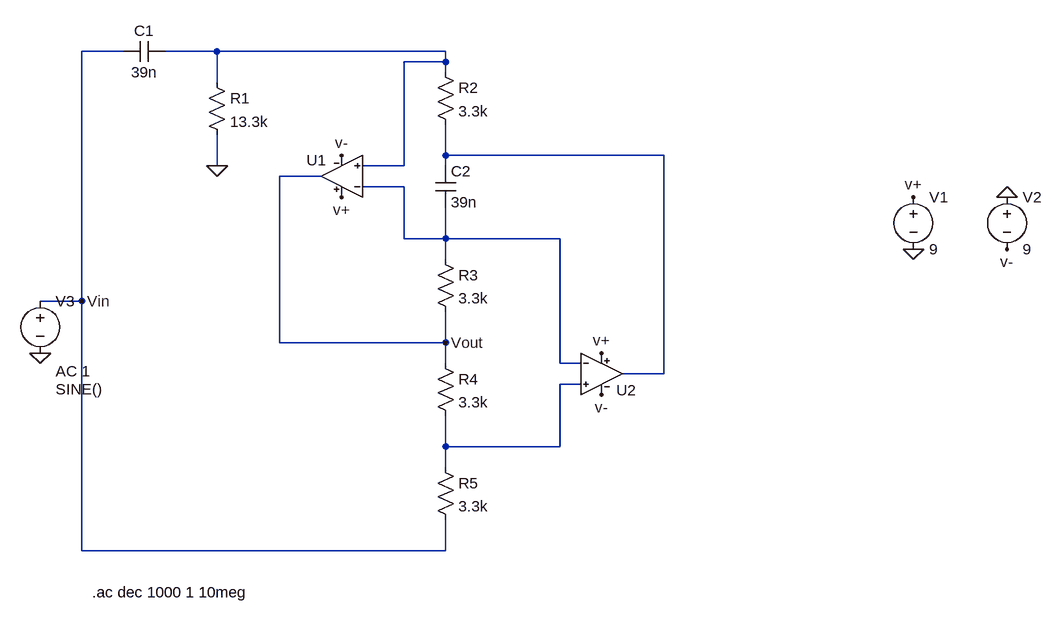
[diagram p0: schematic ej1.asc]
ej1.asc, the LTspice schematic file:
Version 4
SHEET 1 1448 704
WIRE 32 -144 -32 -144
WIRE 176 -144 96 -144
WIRE 528 -144 176 -144
WIRE 528 -128 528 -144
WIRE 528 -128 464 -128
WIRE 528 -112 528 -128
WIRE 176 -96 176 -144
WIRE 528 16 528 -32
WIRE 864 16 528 16
WIRE 176 32 176 -16
WIRE 464 32 464 -128
WIRE 464 32 400 32
WIRE 528 32 528 16
WIRE 336 48 272 48
WIRE 464 64 400 64
WIRE 464 144 464 64
WIRE 528 144 528 96
WIRE 528 144 464 144
WIRE 704 144 528 144
WIRE 528 176 528 144
WIRE -32 240 -32 -144
WIRE -32 240 -96 240
WIRE 272 304 272 48
WIRE 528 304 528 256
WIRE 528 304 272 304
WIRE 528 336 528 304
WIRE 704 336 704 144
WIRE 736 336 704 336
WIRE 864 352 864 16
WIRE 864 352 800 352
WIRE 736 368 704 368
WIRE 528 464 528 416
WIRE 704 464 704 368
WIRE 704 464 528 464
WIRE 528 496 528 464
WIRE -32 624 -32 240
WIRE 528 624 528 576
WIRE 528 624 -32 624
FLAG 176 32 0
FLAG 1248 160 0
FLAG 1392 80 0
FLAG -96 320 0
FLAG 1248 80 v+
FLAG 1392 160 v-
FLAG 368 80 v+
FLAG 768 320 v+
FLAG 368 16 v-
FLAG 768 384 v-
FLAG 528 304 Vout
FLAG -32 240 Vin
SYMBOL cap 96 -160 R90
WINDOW 0 0 32 VBottom 2
WINDOW 3 32 32 VTop 2
SYMATTR InstName C1
SYMATTR Value 39n
SYMBOL cap 512 32 R0
SYMATTR InstName C2
SYMATTR Value 39n
SYMBOL res 160 -112 R0
SYMATTR InstName R1
SYMATTR Value 13.3k
SYMBOL res 512 -128 R0
SYMATTR InstName R2
SYMATTR Value 3.3k
SYMBOL res 512 160 R0
SYMATTR InstName R3
SYMATTR Value 3.3k
SYMBOL res 512 320 R0
SYMATTR InstName R4
SYMATTR Value 3.3k
SYMBOL res 512 480 R0
SYMATTR InstName R5
SYMATTR Value 3.3k
SYMBOL voltage 1248 64 R0
WINDOW 123 0 0 Left 0
WINDOW 39 0 0 Left 0
SYMATTR InstName V1
SYMATTR Value 9
SYMBOL voltage 1392 64 R0
WINDOW 123 0 0 Left 0
WINDOW 39 0 0 Left 0
SYMATTR InstName V2
SYMATTR Value 9
SYMBOL voltage -96 224 R0
WINDOW 3 24 152 Left 2
WINDOW 123 24 124 Left 2
WINDOW 39 0 0 Left 0
SYMATTR Value SINE()
SYMATTR Value2 AC 1
SYMATTR InstName V3
SYMBOL AutoGenerated\\LM833 368 48 R180
SYMATTR InstName U1
SYMBOL AutoGenerated\\LM833 768 352 R0
SYMATTR InstName U2
TEXT -16 688 Left 2 !.ac dec 1000 1 10meg

The netlist it stands for:
* ej1.asc
C1 N001 Vin 39n
C2 N002 N003 39n
R1 N001 0 13.3k
R2 N001 N002 3.3k
R3 N003 Vout 3.3k
R4 Vout N004 3.3k
R5 N004 Vin 3.3k
V1 v+ 0 9
V2 0 v- 9
V3 Vin 0 SINE() AC 1
XU1 N001 N003 v+ v- Vout LM833 LM833 Avol=316.2K GBW=15Meg Slew=5Meg ilimit=25m rail=0 Vos=0 phimargin=60 en=0 enk=0 in=0 ink=0 Rin=175K  ; pins In+ In- V+ V- OUT
XU2 N004 N003 v+ v- N002 LM833 LM833 Avol=316.2K GBW=15Meg Slew=5Meg ilimit=25m rail=0 Vos=0 phimargin=60 en=0 enk=0 in=0 ink=0 Rin=175K  ; pins In+ In- V+ V- OUT
.ac dec 1000 1 10meg
.lib LM833.sub
.backanno
.end